# EAGLE design rapidshark-display-shifter-mk-1.0 (EAGLE 6.5.0)
AUTHOR: sean@yak.net
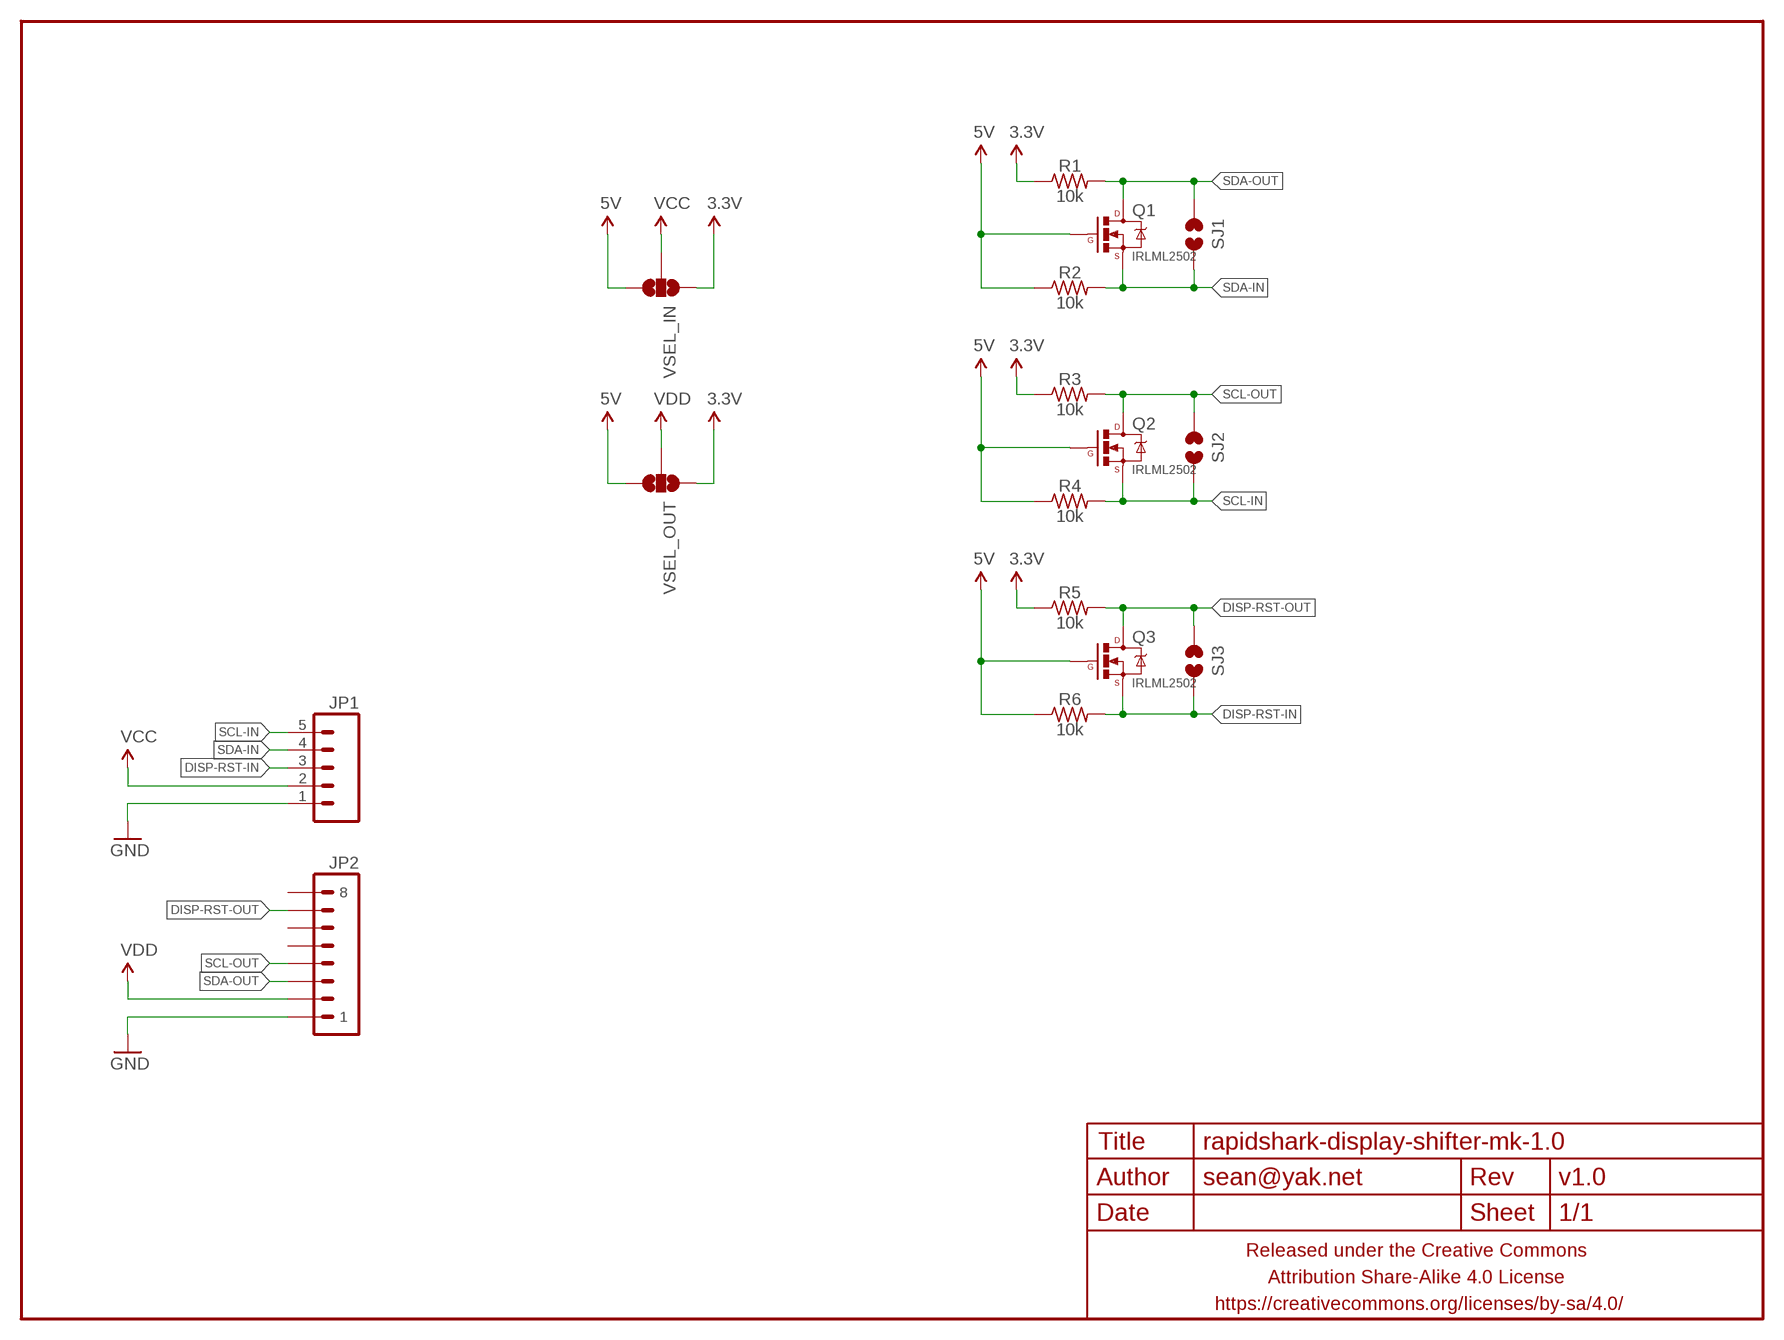
[diagram p0: schematic, sheet 1]

## Parts
FRAME1  FRAME-LETTERNO_PACKAGE  [DUMMY]
JP1  M05JST-PH-VERT-PTH  [JST-5-PH-VERT-PTH]
JP2  M081X08  [1X08]
Q1  IRLML2502  MOSFET-NCHANNELIRLML2502  [SOT23]
Q2  IRLML2502  MOSFET-NCHANNELIRLML2502  [SOT23]
Q3  IRLML2502  MOSFET-NCHANNELIRLML2502  [SOT23]
R1  10k  RESISTORR0805  [R0805]
R2  10k  RESISTORR0805  [R0805]
R3  10k  RESISTORR0805  [R0805]
R4  10k  RESISTORR0805  [R0805]
R5  10k  RESISTORR0805  [R0805]
R6  10k  RESISTORR0805  [R0805]
SJ1  JUMPER-PAD-2-NOYES_SILK  [PAD-JUMPER-2-NO_YES_SILK]
SJ2  JUMPER-PAD-2-NOYES_SILK  [PAD-JUMPER-2-NO_YES_SILK]
SJ3  JUMPER-PAD-2-NOYES_SILK  [PAD-JUMPER-2-NO_YES_SILK]
VSEL_IN  JUMPER-PAD-3-NOFULL_BOX_SILK  [PAD-JUMPER-3-NO_YES_SILK_FULL_BOX]
VSEL_OUT  JUMPER-PAD-3-NOFULL_BOX_SILK  [PAD-JUMPER-3-NO_YES_SILK_FULL_BOX]

## Nets
3.3V: R1.1 R3.1 R5.1 VSEL_IN.1 VSEL_OUT.1
5V: Q1.1(G) Q2.1(G) Q3.1(G) R2.1 R4.1 R6.1 VSEL_IN.3 VSEL_OUT.3
DISP-RST-IN: JP1.3 Q3.2(S) R6.2 SJ3.1
DISP-RST-OUT: JP2.7 Q3.3(D) R5.2 SJ3.2
GND: JP1.1 JP2.1
SCL-IN: JP1.5 Q2.2(S) R4.2 SJ2.1
SCL-OUT: JP2.4 Q2.3(D) R3.2 SJ2.2
SDA-IN: JP1.4 Q1.2(S) R2.2 SJ1.1
SDA-OUT: JP2.3 Q1.3(D) R1.2 SJ1.2
VCC: JP1.2 VSEL_IN.2
VDD: JP2.2 VSEL_OUT.2
Unconnected: JP2.5 JP2.6 JP2.8

## Library data of the parts
FRAME1 = A_butts:FRAME-LETTER: Schematic Frame Standard 8.5x11 US Letter frame; DESIGNER: sean@yak.net; VERSION: v1.0
JP1 = A_butts:M05: Header 5 Standard 5-pin 0.1" header. Use with straight break away headers (SKU : PRT-00116), right angle break away headers (PRT-00553), swiss pins (PRT-00743), machine pins (PRT-00117), and female headers (PRT-00115). Molex polarized connector foot print use with SKU : PRT-08230 with associated crimp pins and housings.
JP2 = A_butts:M08: Header 8 Standard 8-pin 0.1" header. Use with straight break away headers (SKU : PRT-00116), right angle break away headers (PRT-00553), swiss pins (PRT-00743), machine pins (PRT-00117), and female headers (PRT-00115).
Q1-Q3 = A_butts:MOSFET-NCHANNEL: Common NMOSFET Parts MFG P/N Store ID Prod ID FDD8780 TRANS-09984 SI7820DN TRANS-11055 FDS6630A IC-08089 2N7002PW TRANS-11151 FQP30N06L COM-10213 TRANS-10060 BSS123LT1G TRANS-08345 BSS138 TRANS-00830 BS170 2N7000
R1-R6 = A_butts:RESISTOR: RESISTOR, American symbol
SJ1-SJ3 = A_butts:JUMPER-PAD-2-NO
VSEL_IN VSEL_OUT = A_butts:JUMPER-PAD-3-NO

## Board
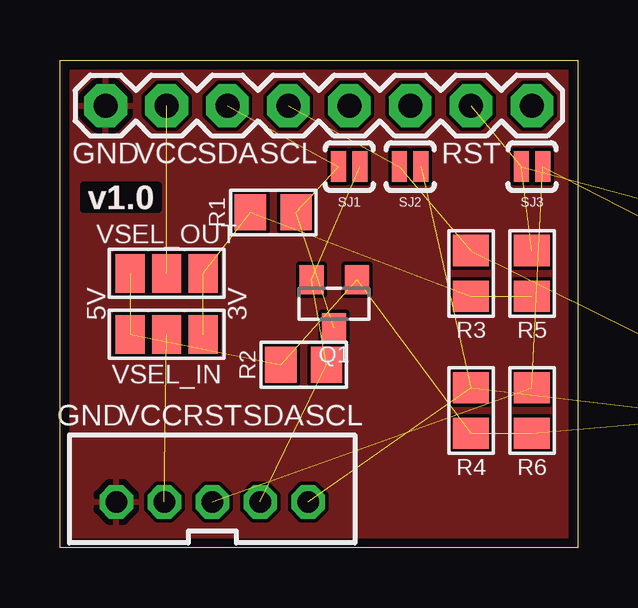
[diagram p1: board, top side]
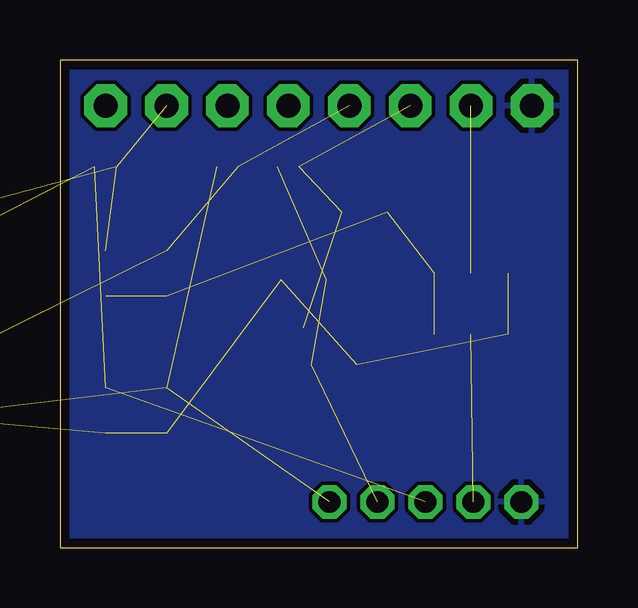
[diagram p2: board, bottom side, seen from below]

Size 21.59 x 20.32 mm. Coordinates in mm from the lower left corner, seen from the top.
Outline: 21.59,0 0,0 0,20.32 21.59,20.32 21.59,0
Copper layers (1*16): Top 0.0356mm / dielectric 1.5011mm / Bottom 0.0356mm
Design rules "LaenPCBOrder_2": minimum track width 6mil, minimum drill 13mil, track to track 6mil, track to pad 6mil, pad to pad 6mil, via to via 6mil, smd to smd 6mil, copper to edge 15mil, drill to drill 6mil, minimum pad ring 7mil, minimum via ring 7mil, stop-mask expansion 3mil, vias tented up to drill 20mil, thermal gap 10mil

### Footprints (pad centres in the part's own frame; a part is rotated, then mirrored left to right if it is on the bottom)
JST-5-PH-VERT-PTH = drill 0.9 pad 1.4 octagon: 1 -4,0; 2 -2,0; 3 0,0; 4 2,0; 5 4,0
1X08 = drill 1 pad 1.778 octagon: 1 0,0; 2 2.54,0; 3 5.08,0; 4 7.62,0; 5 10.16,0; 6 12.7,0; 7 15.24,0; 8 17.78,0
SOT23 = smd 1 x 1.2: 1 -0.95,-1; 2 0.95,-1; 3 0,1
R0805 = smd 1.3 x 1.5: 1 -0.95,0; 2 0.95,0
PAD-JUMPER-2-NO_YES_SILK = smd 0.635 x 1.27: 1 -0.45,0; 2 0.45,0
PAD-JUMPER-3-NO_YES_SILK_FULL_BOX = smd 1.2 x 1.6: 1 -1.524,0; 2 0,0; 3 1.524,0

### Placement (x,y rotation side)
FRAME1  0,0 270 bottom
JP1  6.35,1.91 0 top
JP2  1.91,18.41 0 top
Q1  11.43,10.16 180 top
Q2  27.3,6.35 0 top  (outside the outline)
Q3  27.3,12.7 0 top  (outside the outline)
R1  8.89,13.97 0 top
R2  10.16,7.62 0 top
R3  17.14,11.43 90 top
R4  17.14,5.71 90 top
R5  19.68,11.43 90 top
R6  19.68,5.71 90 top
SJ1  12.06,15.88 180 top
SJ2  14.61,15.88 180 top
SJ3  19.68,15.88 180 top
VSEL_IN  4.45,8.89 180 top
VSEL_OUT  4.45,11.43 180 top

### Tracks (layer width: path | path; a pad name or v marks a point on that pad's centre or on a via)
3.3V  (4 unrouted)
5V  (7 unrouted)
DISP-RST-IN  (3 unrouted)
DISP-RST-OUT  (3 unrouted)
GND
  pour Top (rank 6): 21.59,0 0,0 0,20.32 21.59,20.32
  pour Bottom (rank 6): 21.59,0 0,0 0,20.32 21.59,20.32
SCL-IN  (3 unrouted)
SCL-OUT  (3 unrouted)
SDA-IN  (3 unrouted)
SDA-OUT  (3 unrouted)
VCC  (1 unrouted)
VDD  (1 unrouted)

### Text on the board
tPlace: GND | VCC | SDA | SCL | RST | 5V | 3V | GND | VCC | RST | SDA | SCL